# EasyEDA Pro project KAKUTE_mini.eprj

# Schematic KAKUTE-mini

## Sheets
1 主控: Create Date: 2023-04-20; Page Name: 主控; Project Name: KAKUTE_mini; Schematic Name: KAKUTE-mini; Update Date: 2023-05-05; Company: 嘉立创EDA; Drawed: WANG BIN; Page Size: A4; Version: V1.0
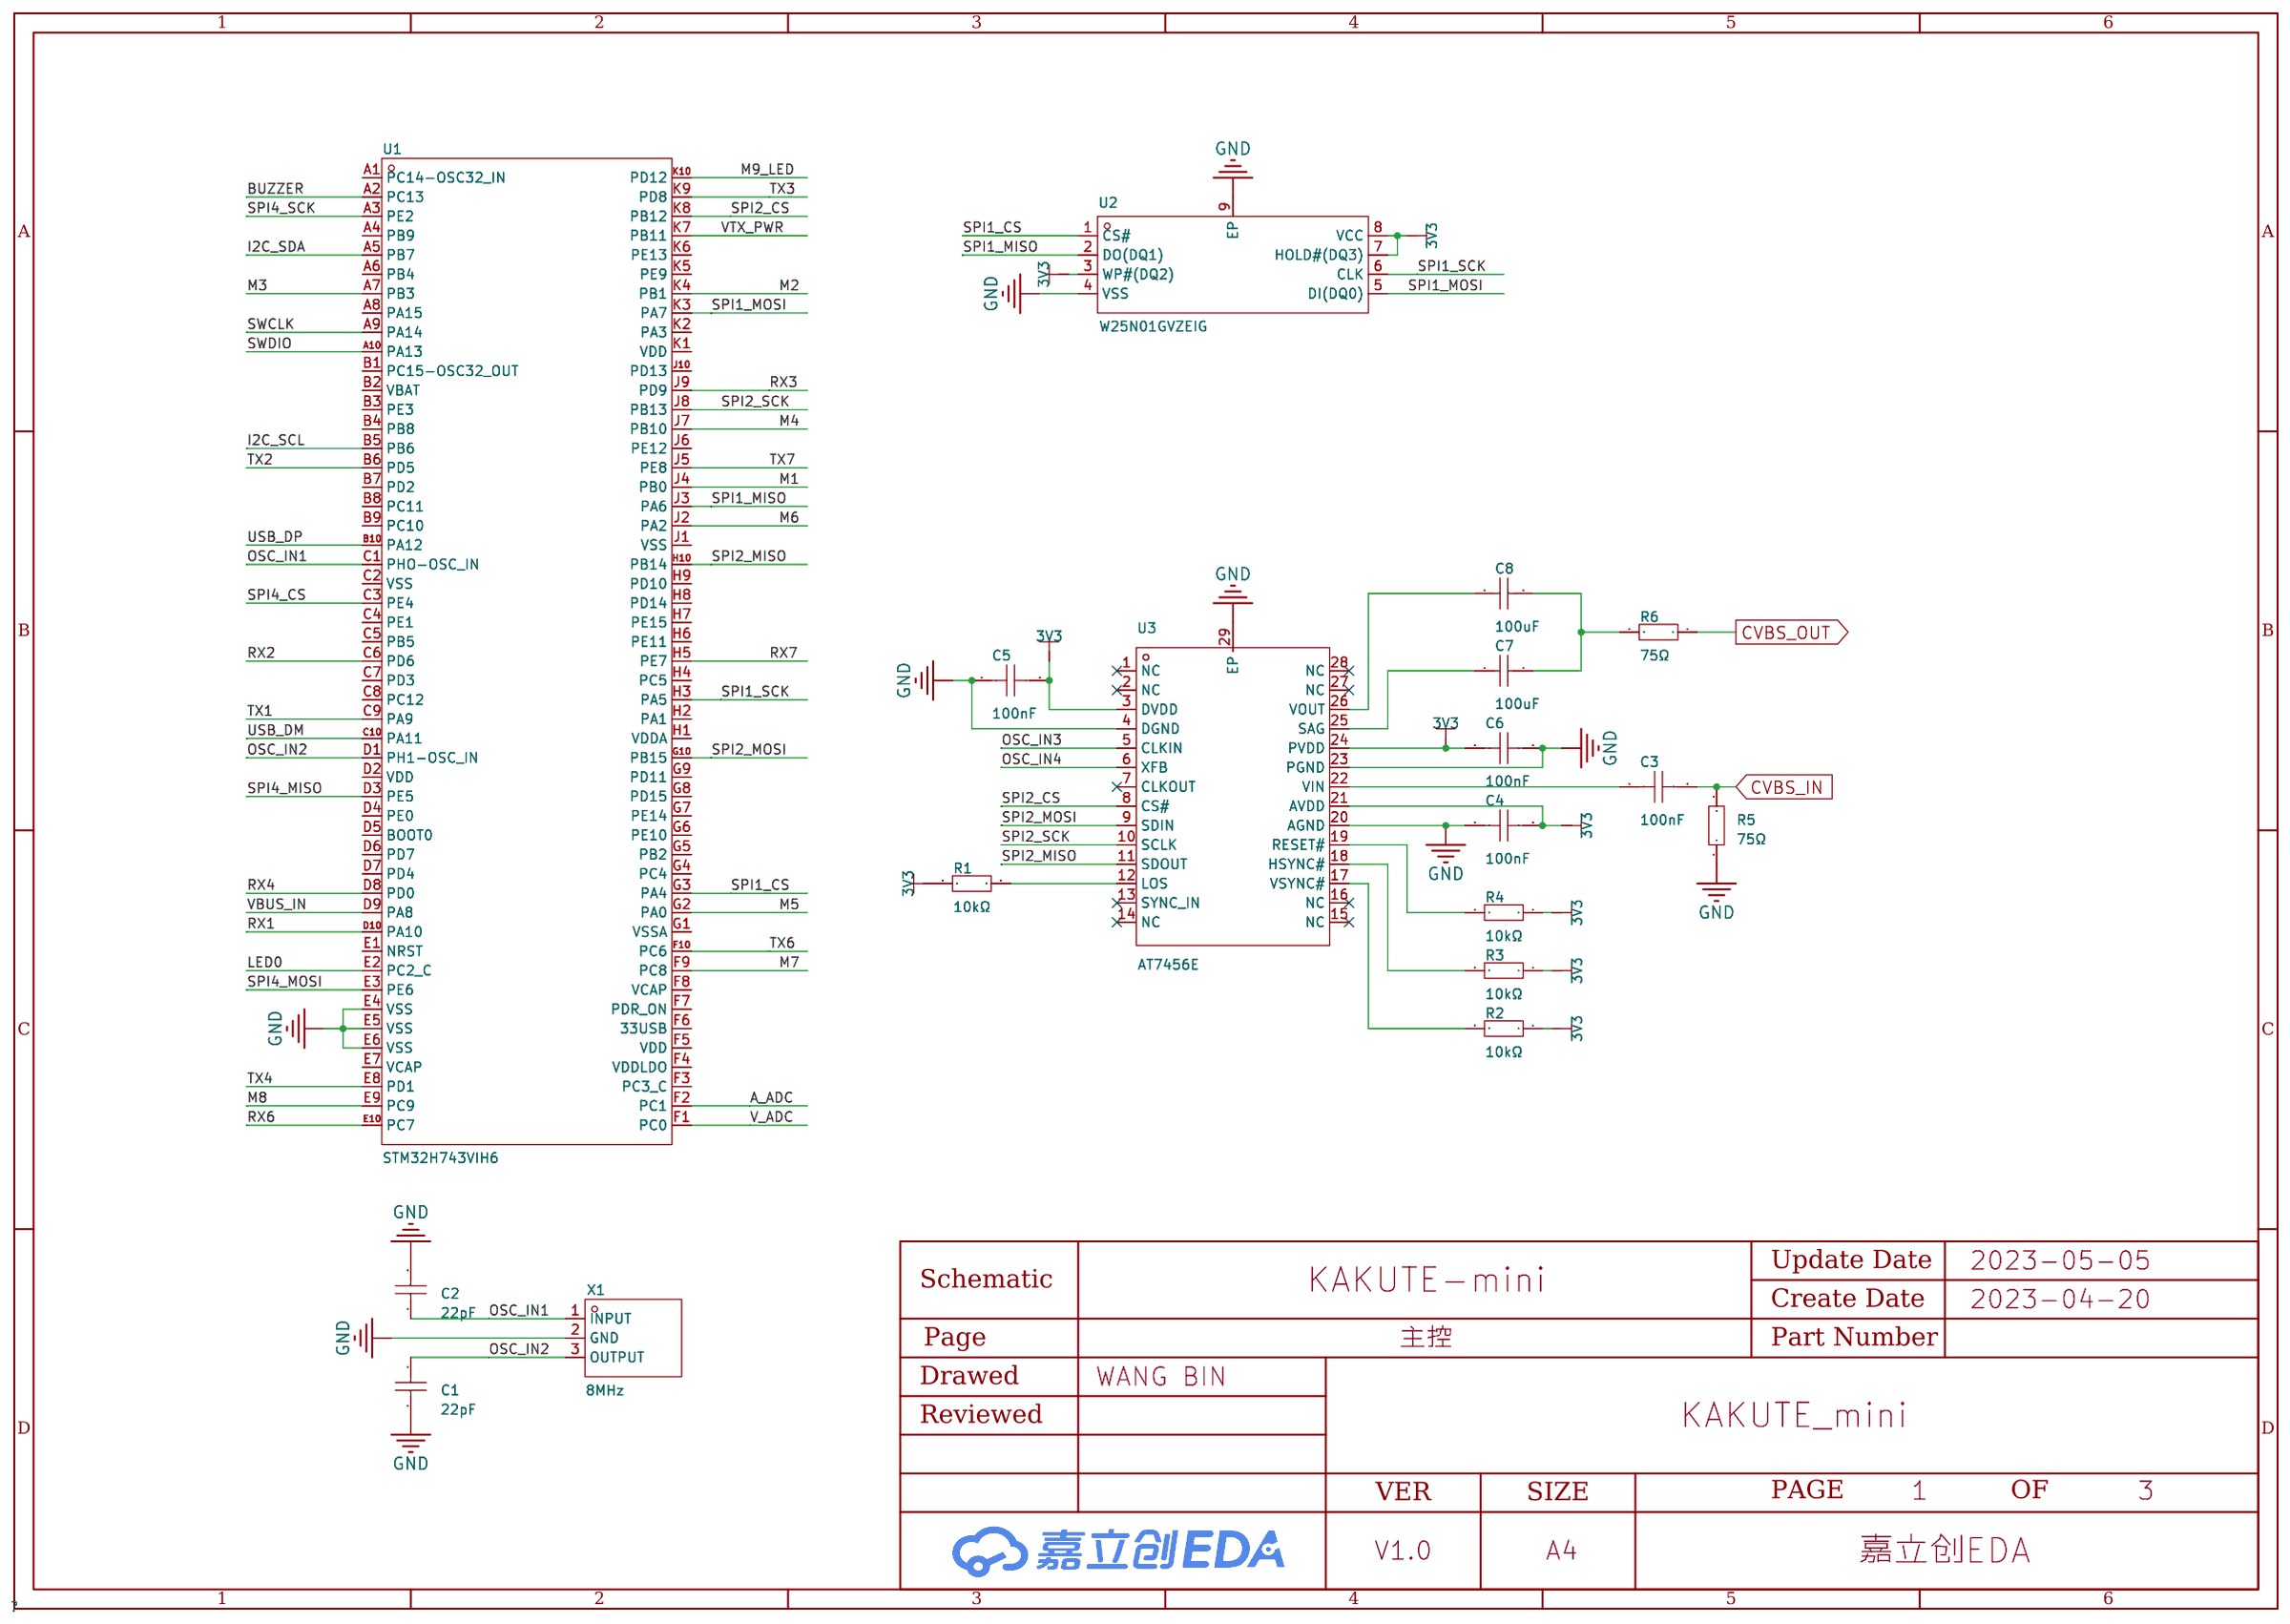
[diagram p0: 主控]
2 接插件: Page Name: 接插件; Update Date: 2023-04-20
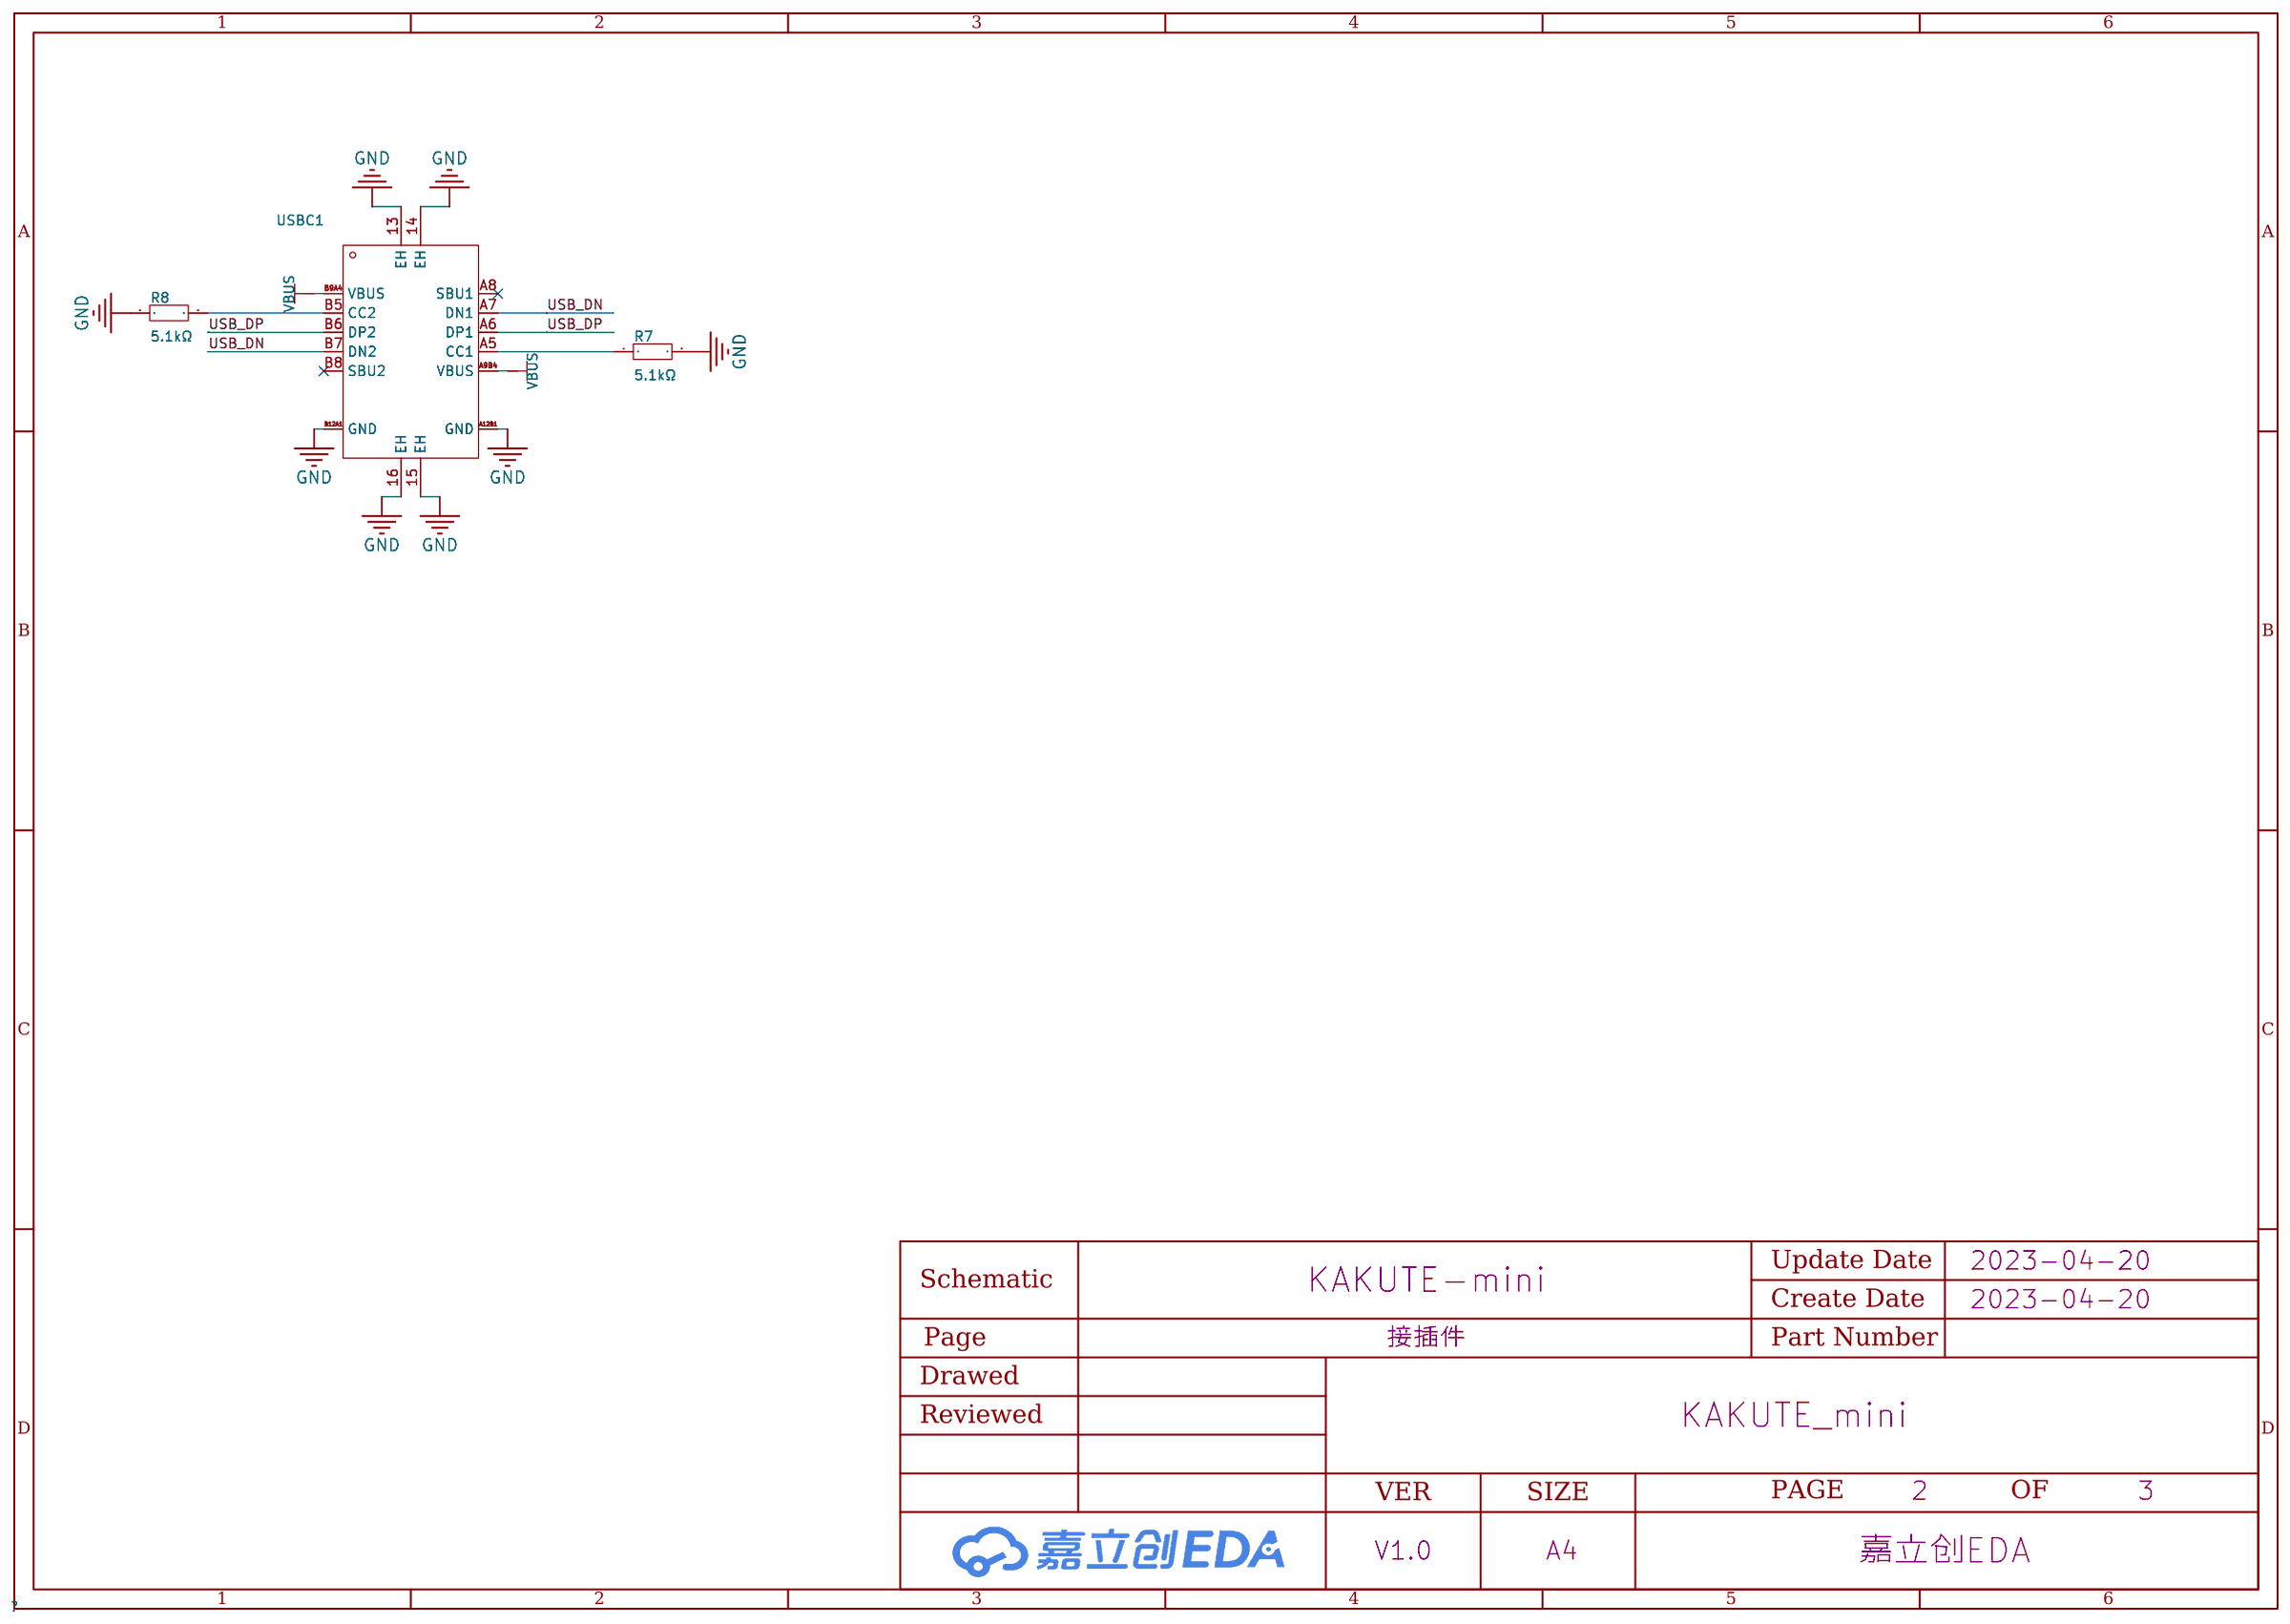
[diagram p1: 接插件]
3 传感器: Page Name: 传感器; Schematic Name: Schematic1; Update Date: 2023-04-20
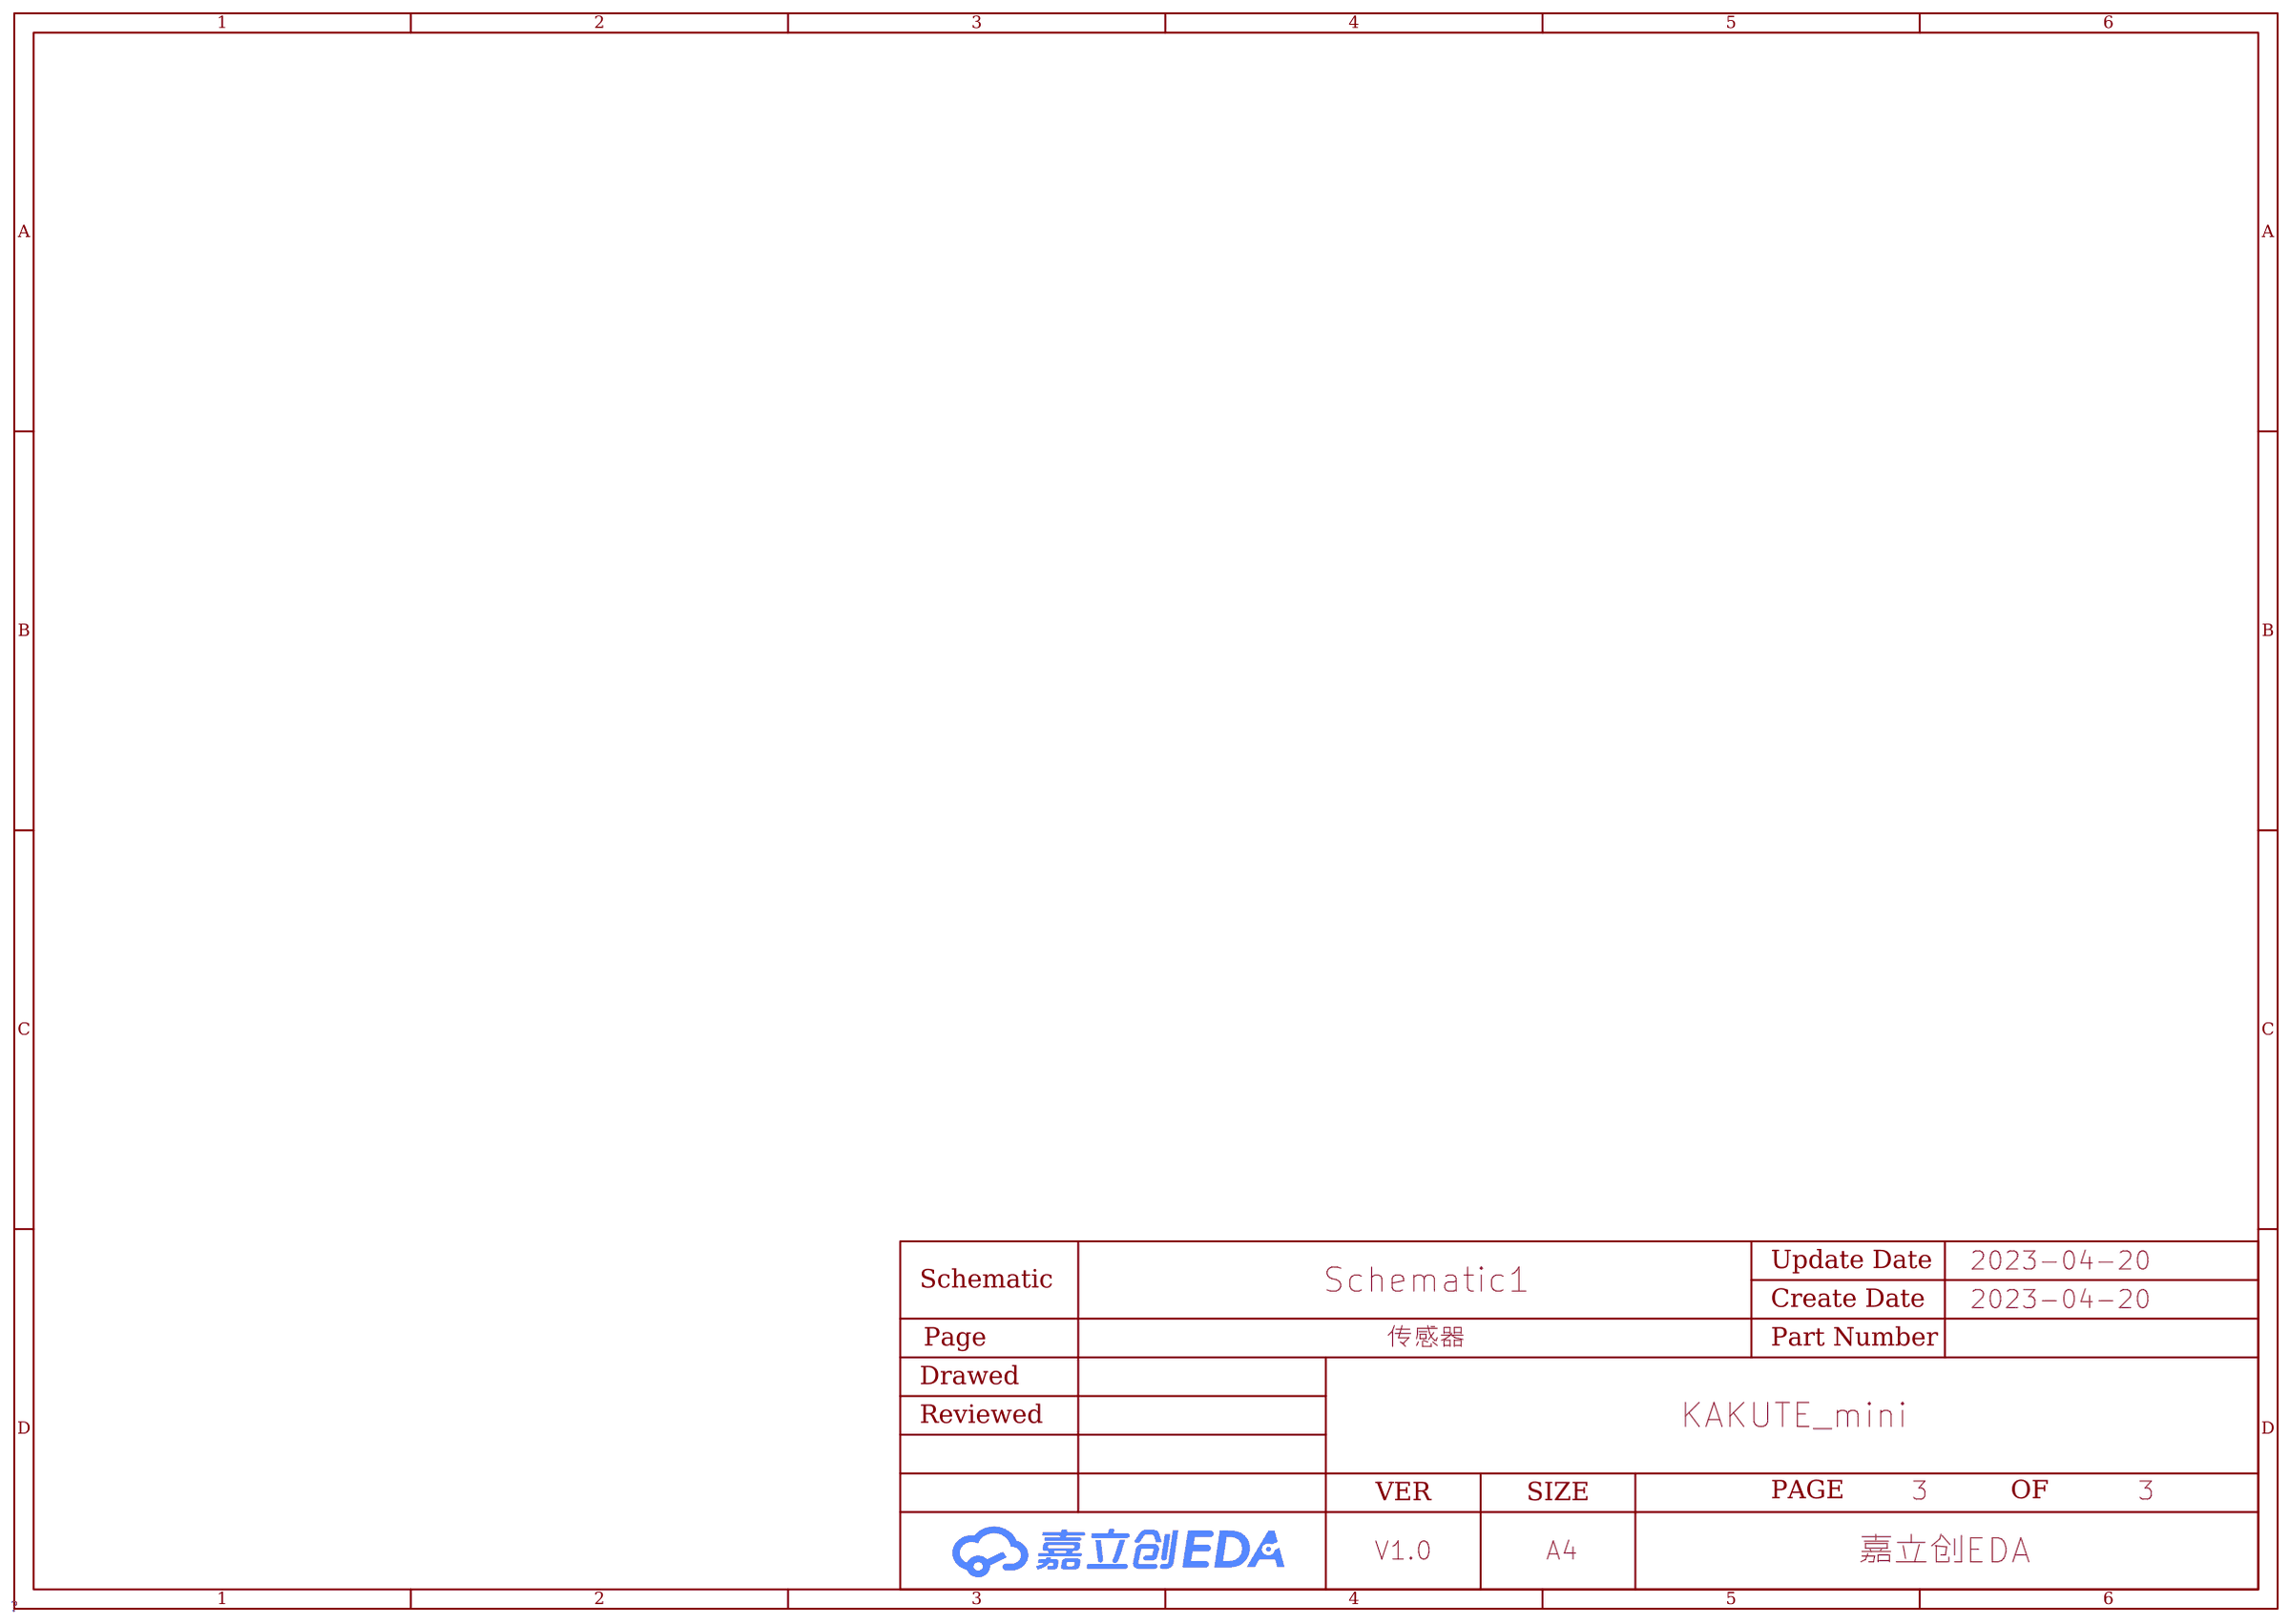
[diagram p2: 传感器]

## Parts
sheet 主控
C1  22pF  [C0402]
C2  22pF  [C0402]
C3  100nF  [C0402]
C4  100nF  [C0402]
C5  100nF  [C0402]
C6  100nF  [C0402]
C7  100uF  [C0805]
C8  100uF  [C0805]
R1  10kΩ  [R0402]
R2  10kΩ  [R0402]
R3  10kΩ  [R0402]
R4  10kΩ  [R0402]
R5  75Ω  [R0402]
R6  75Ω  [R0402]
U1  STM32H743VIH6  [BGA-100_L8.0-W8.0-P0.80-R10-C10-BL]
U2  W25N01GVZEIG  [WSON-8_L8.0-W6.10-P1.27-BL-EP]
U3  AT7456E  [TSSOP-28_L9.7-W4.4-P0.65-LS6.4-BL-EP-2]
X1  8MHz  [OSC-SMD_3P-L3.2-W1.3-P1.20-L]
sheet 接插件
R7  5.1kΩ  [R0402]
R8  5.1kΩ  [R0402]
USBC1  918-418K2024S40000  [USB-C-SMD_TYPE-C-USB-4]

## Library data of the parts
C1 C2 = 0402CG220J500NT: 容值:22pF;精度:±5%;额定电压:50V;材质(温度系数):C0G;; LCSC Part Name: 22pF ±5% 50V; Supplier Part: C1555; Manufacturer: FH(风华); Supplier Footprint: 0402; JLCPCB Part Class: 基础库; Datasheet: https://atta.szlcsc.com/upload/public/pdf/source/20170923/C1555_1506149269156988362.pdf; Supplier: LCSC; Tolerance: ±5%; Voltage Rated: 50V; Temperature Coefficient: C0G
C3-C6 = CL05B104KB54PNC: 容值:100nF;精度:±10%;额定电压:50V;材质(温度系数):X7R;; LCSC Part Name: 100nF ±10% 50V; Supplier Part: C307331; Manufacturer: SAMSUNG(三星); Supplier Footprint: 0402; JLCPCB Part Class: 基础库; Datasheet: https://atta.szlcsc.com/upload/public/pdf/source/20181009/C307331_222F7C870FD3EA5F46F538B483443886.pdf; Supplier: LCSC; Tolerance: ±10%; Voltage Rated: 50V; Temperature Coefficient: X7R
C7 C8 = GRM21BR60J107ME15L: 容值:100uF;精度:±20%;额定电压:6.3V;材质(温度系数):X5R;; LCSC Part Name: 100uF ±20% 6.3V; Supplier Part: C141660; Manufacturer: muRata(村田); Supplier Footprint: 0805; JLCPCB Part Class: Extended Part; Datasheet: https://atta.szlcsc.com/upload/public/pdf/source/20171113/C141660_15105613320671115822.pdf; Supplier: LCSC; Tolerance: ±20%; Voltage Rated: 6.3V; Temperature Coefficient: X5R
R1-R4 = 0402WGF1002TCE: 电阻类型:厚膜电阻;阻值:10kΩ;精度:±1%;功率:62.5mW;; LCSC Part Name: 10kΩ ±1% 62.5mW; Supplier Part: C25744; Manufacturer: UNI-ROYAL(厚声); Supplier Footprint: 0402; JLCPCB Part Class: Basic Part; Datasheet: https://atta.szlcsc.com/upload/public/pdf/source/20200306/C422600_1E6D84923E4A46A82E41ADD87F860B5C.pdf; Supplier: LCSC; Type: 厚膜电阻; Tolerance: ±1%; Power(Watts): 62.5mW; Temperature Coefficient: ±100ppm/℃; Overload Voltage (Max): 50V; Operating Temperature Range: -55℃~+155℃
R5 R6 = 0402WGF750JTCE: 电阻类型:厚膜电阻;阻值:75Ω;精度:±1%;功率:62.5mW;; LCSC Part Name: 75Ω ±1% 62.5mW; Supplier Part: C25133; Manufacturer: UNI-ROYAL(厚声); Supplier Footprint: 0402; JLCPCB Part Class: 基础库; Datasheet: https://atta.szlcsc.com/upload/public/pdf/source/20200306/C422600_1E6D84923E4A46A82E41ADD87F860B5C.pdf; Supplier: LCSC; Type: 厚膜电阻; Tolerance: ±1%; Power(Watts): 62.5mW; Temperature Coefficient: ±100ppm/℃; Overload Voltage (Max): 50V; Operating Temperature Range: -55℃~+155℃
U1 = STM32H743VIH6: 32位Arm Cortex -M7 480MHz mcu,高达2MB的Flash,高达1MB的RAM,46com和模拟接口; Supplier Part: C964146; Manufacturer: ST(意法半导体); Supplier Footprint: TFBGA-100; JLCPCB Part Class: 扩展库; Datasheet: https://atta.szlcsc.com/upload/public/pdf/source/20220307/46489B78091107FB73FE6602EFA9948C.pdf; Supplier: LCSC
U2 = W25N01GVZEIG: 存储器类型:-;存储器构架(格式):-;技术:-;存储器容量:-;时钟频率:-;存储器接口类型:-;; Supplier Part: C907680; Manufacturer: WINBOND(华邦); Supplier Footprint: WSON-8; JLCPCB Part Class: 扩展库; Datasheet: https://atta.szlcsc.com/upload/public/pdf/source/20201021/C907645_0A29D2C383E097D6F46BF0FEEFAA9DEB.pdf; Supplier: LCSC
U3 = AT7456E: 视频字符叠加芯片，跟MAX7456-pin-pin; Supplier Part: C82351; Manufacturer: 杭州中科微; Supplier Footprint: TSSOP-28; JLCPCB Part Class: 扩展库; Datasheet: https://atta.szlcsc.com/upload/public/pdf/source/20180326/C82351_A40539A53E8345C88178541014FDE5FB.pdf; Supplier: LCSC
X1 = CSTNE8M00GH5L000R0: 频率:8MHz;频率公差:±0.07%;频率稳定度:-;; LCSC Part Name: 8MHz ±0.07%; Supplier Part: C882602; Manufacturer: muRata(村田); Supplier Footprint: SMD3213-3P; JLCPCB Part Class: 扩展库; Datasheet: https://atta.szlcsc.com/upload/public/pdf/source/20210726/C882602_740E1448EDBB3C55C7DDB16518B64D07.pdf; Supplier: LCSC; Frequency Tolerance: ±0.07%; Operating Temperature: -40℃~+85℃
R7 R8 = 0402WGF5101TCE: 电阻类型:厚膜电阻;阻值:5.1kΩ;精度:±1%;功率:62.5mW;; LCSC Part Name: 5.1kΩ ±1% 62.5mW; Supplier Part: C25905; Manufacturer: UNI-ROYAL(厚声); Supplier Footprint: 0402; JLCPCB Part Class: 基础库; Datasheet: https://atta.szlcsc.com/upload/public/pdf/source/20200306/C422600_1E6D84923E4A46A82E41ADD87F860B5C.pdf; Supplier: LCSC; Type: 厚膜电阻; Tolerance: ±1%; Power(Watts): 62.5mW; Temperature Coefficient: ±100ppm/℃; Overload Voltage (Max): 50V; Operating Temperature Range: -55℃~+155℃
USBC1 = 918-418K2024S40000: 连接器类型:Type-C;标准:-;公母:母座;触点数量:16;端口数量:1;; LCSC Part Name: Type-C 母座; Supplier Part: C168688; Manufacturer: 精拓金; Supplier Footprint: SMD; JLCPCB Part Class: 扩展库; Datasheet: https://atta.szlcsc.com/upload/public/pdf/source/20210305/C168688_67E9870F07D1BBFDE7A21510679CE418.pdf; Supplier: LCSC; Connector Type: Type-C; Gender: 母座; Number of Contacts: 16; Number of Ports: 1

## Nets
3V3: C4.2 C5.2 C6.1 R1.1 R2.1 R3.1 R4.1 U2.3(WP#(DQ2)) U2.7(HOLD#(DQ3)) U2.8(VCC) U3.3(DVDD) U3.21(AVDD) U3.24(PVDD)
GND: C1.2 C2.2 C4.1 C5.1 C6.2 R5.1 R7.2 R8.1 U1.E4(VSS) U1.E5(VSS) U1.E6(VSS) U2.4(VSS) U2.9(EP) U3.4(DGND) U3.20(AGND) U3.23(PGND) U3.29(EP) USBC1.13(EH) USBC1.14(EH) USBC1.15(EH) USBC1.16(EH) USBC1.A12B1(GND) USBC1.B12A1(GND) X1.2(GND)
VBUS: USBC1.A9B4(VBUS) USBC1.B9A4(VBUS)
VBUS_IN: U1.D9(PA8)
A_ADC: U1.F2(PC1)
BUZZER: U1.A2(PC13)
CVBS_IN: C3.2 R5.2
CVBS_OUT: R6.1
I2C_SCL: U1.B5(PB6)
I2C_SDA: U1.A5(PB7)
LED0: U1.E2(PC2_C)
M1: U1.J4(PB0)
M2: U1.K4(PB1)
M3: U1.A7(PB3)
M4: U1.J7(PB10)
M5: U1.G2(PA0)
M6: U1.J2(PA2)
M7: U1.F9(PC8)
M8: U1.E9(PC9)
M9_LED: U1.K10(PD12)
OSC_IN1: C2.1 U1.C1(PHO-OSC_IN) X1.1(INPUT)
OSC_IN2: C1.1 U1.D1(PH1-OSC_IN) X1.3(OUTPUT)
OSC_IN3: U3.5(CLKIN)
OSC_IN4: U3.6(XFB)
RX1: U1.D10(PA10)
RX2: U1.C6(PD6)
RX3: U1.J9(PD9)
RX4: U1.D8(PD0)
RX6: U1.E10(PC7)
RX7: U1.H5(PE7)
SPI1_CS: U1.G3(PA4) U2.1(CS#)
SPI1_MISO: U1.J3(PA6) U2.2(DO(DQ1))
SPI1_MOSI: U1.K3(PA7) U2.5(DI(DQ0))
SPI1_SCK: U1.H3(PA5) U2.6(CLK)
SPI2_CS: U1.K8(PB12) U3.8(CS#)
SPI2_MISO: U1.H10(PB14) U3.11(SDOUT)
SPI2_MOSI: U1.G10(PB15) U3.9(SDIN)
SPI2_SCK: U1.J8(PB13) U3.10(SCLK)
SPI4_CS: U1.C3(PE4)
SPI4_MISO: U1.D3(PE5)
SPI4_MOSI: U1.E3(PE6)
SPI4_SCK: U1.A3(PE2)
SWCLK: U1.A9(PA14)
SWDIO: U1.A10(PA13)
TX1: U1.C9(PA9)
TX2: U1.B6(PD5)
TX3: U1.K9(PD8)
TX4: U1.E8(PD1)
TX6: U1.F10(PC6)
TX7: U1.J5(PE8)
USB_DM: U1.C10(PA11)
USB_DN: USBC1.A7(DN1) USBC1.B7(DN2)
USB_DP: U1.B10(PA12) USBC1.A6(DP1) USBC1.B6(DP2)
V_ADC: U1.F1(PC0)
VTX_PWR: U1.K7(PB11)
$1N3519: R1.2 U3.12(LOS)
$1N3965: R2.2 U3.17(VSYNC#)
$1N4203: R3.2 U3.18(HSYNC#)
$1N4208: R4.2 U3.19(RESET#)
$1N4273: C3.1 U3.22(VIN)
$1N4642: C8.1 U3.26(VOUT)
$1N4647: C7.1 U3.25(SAG)
$1N4793: C7.2 C8.2 R6.2
Net-(R7-1): R7.1 USBC1.A5(CC1)
Net-(R8-2): R8.2 USBC1.B5(CC2)

Not connected (* = marked no-connect by the designer): U1 A1(PC14-OSC32_IN) A4(PB9) A6(PB4) A8(PA15) B1(PC15-OSC32_OUT) B2(VBAT) B3(PE3) B4(PB8) B7(PD2) B8(PC11) B9(PC10) C2(VSS) C4(PE1) C5(PB5) C7(PD3) C8(PC12) D2(VDD) D4(PE0) D5(BOOT0) D6(PD7) D7(PD4) E1(NRST) E7(VCAP) F3(PC3_C) F4(VDDLDO) F5(VDD) F6(33USB) F7(PDR_ON) F8(VCAP) G1(VSSA) G4(PC4) G5(PB2) G6(PE10) G7(PE14) G8(PD15) G9(PD11) H1(VDDA) H2(PA1) H4(PC5) H6(PE11) H7(PE15) H8(PD14) H9(PD10) J1(VSS) J6(PE12) J10(PD13) K1(VDD) K2(PA3) K5(PE9) K6(PE13); U3 1(NC)* 2(NC)* 7(CLKOUT)* 13(SYNC_IN)* 14(NC)* 15(NC)* 16(NC)* 27(NC)* 28(NC)*; USBC1 A8(SBU1)* B8(SBU2)*

# Board PCB1
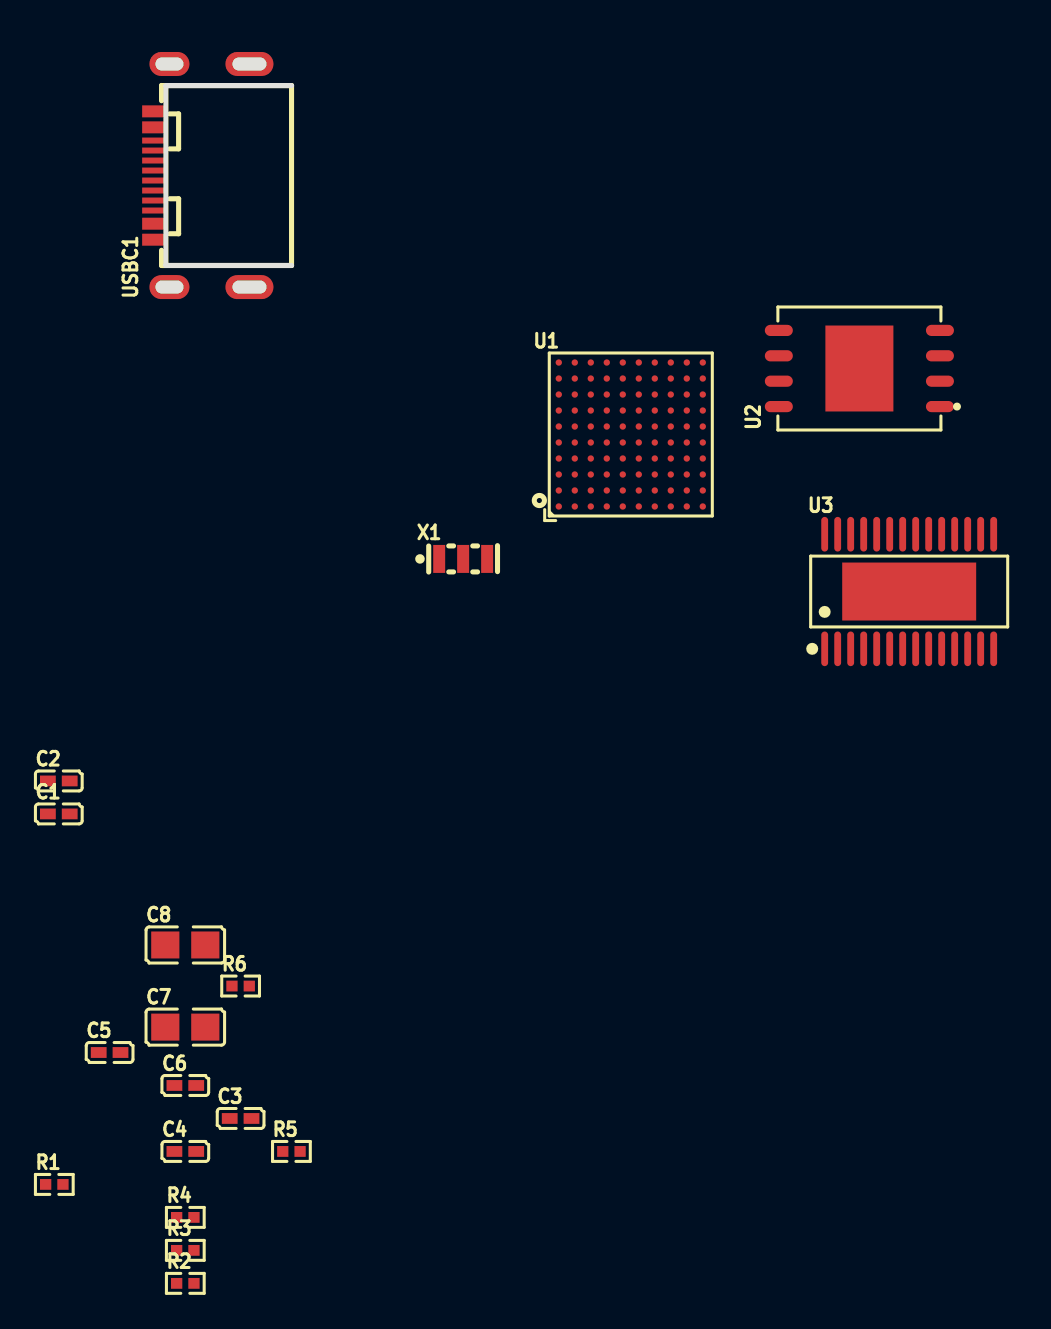
[diagram p3: board, top side]
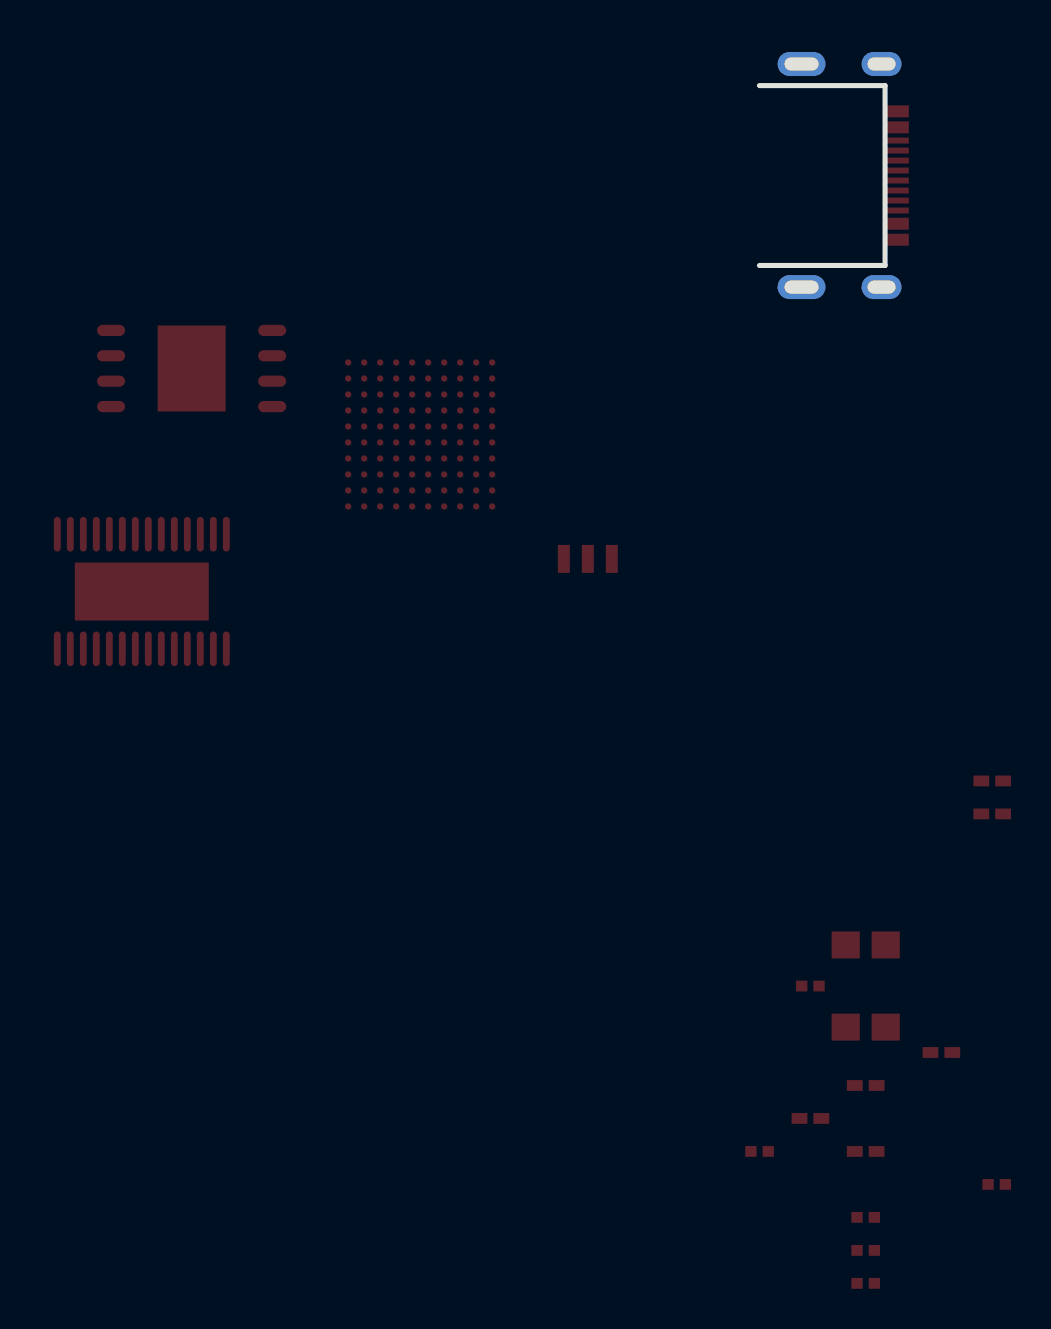
[diagram p4: board, bottom side, seen from below]

Outline 6.28 x 9 mm; copper layers: Top Layer, Bottom Layer. Coordinates in mm from the lower left corner of the outline.
Stack: Top Layer 0.035mm / Dielectric1 1.51mm FR4 er 4.5 / Bottom Layer 0.035mm

## Design rules (mm)
spacing safeClearance (default): track to track 0.152, other pairs 0.152 to 0.3
track width trackWidth (default): min 0.127, default 0.254, max 2.54
differential pair differentialPair (default): width min 0.127, default 0.254, max 2.54; gap min 0.152, default 0.152
via viaSize (default): diameter min 0.5, default 0.61, max 10; hole min 0.3, default 0.305, max 6

## Placement (name value [footprint] x y rotation side)
C1  22pF  [C0402]  -5.36 -27.43 0 top
C2  22pF  [C0402]  -5.36 -25.78 0 top
C3  100nF  [C0402]  3.73 -42.67 0 top
C4  100nF  [C0402]  0.97 -44.32 0 top
C5  100nF  [C0402]  -2.82 -39.37 0 top
C6  100nF  [C0402]  0.97 -41.02 0 top
C7  100uF  [C0805]  0.97 -38.1 0 top
C8  100uF  [C0805]  0.97 -33.99 0 top
R1  10kΩ  [R0402]  -5.58 -45.97 0 top
R2  10kΩ  [R0402]  0.97 -50.91 0 top
R3  10kΩ  [R0402]  0.97 -49.26 0 top
R4  10kΩ  [R0402]  0.97 -47.61 0 top
R5  75Ω  [R0402]  6.27 -44.32 0 top
R6  75Ω  [R0402]  3.73 -36.04 0 top
U1  STM32H743VIH6  [BGA-100_L8.0-W8.0-P0.80-R10-C10-BL]  23.24 -8.45 0 top
U2  W25N01GVZEIG  [WSON-8_L8.0-W6.10-P1.27-BL-EP]  34.67 -5.15 90 top
U3  AT7456E  [TSSOP-28_L9.7-W4.4-P0.65-LS6.4-BL-EP-2]  37.16 -16.31 0 top
USBC1  918-418K2024S40000  [USB-C-SMD_TYPE-C-USB-4]  1.78 4.5 90 top
X1  8MHz  [OSC-SMD_3P-L3.2-W1.3-P1.20-L]  14.86 -14.68 0 top

## Footprints (pads in the part's own frame, mm; a bottom-side part is the same pattern mirrored in y, then rotated)
BGA-100_L8.0-W8.0-P0.80-R10-C10-BL
  round 0.32 smd: A1(-3.6,-3.6) A2(-3.6,-2.8) A3(-3.6,-2) A4(-3.6,-1.2) A5(-3.6,-0.4) A6(-3.6,0.4) A7(-3.6,1.2) A8(-3.6,2) A9(-3.6,2.8) A10(-3.6,3.6) B1(-2.8,-3.6) B2(-2.8,-2.8) B3(-2.8,-2) B4(-2.8,-1.2) B5(-2.8,-0.4) B6(-2.8,0.4) B7(-2.8,1.2) B8(-2.8,2) B9(-2.8,2.8) B10(-2.8,3.6) C1(-2,-3.6) C2(-2,-2.8) C3(-2,-2) C4(-2,-1.2) C5(-2,-0.4) C6(-2,0.4) C7(-2,1.2) C8(-2,2) C9(-2,2.8) C10(-2,3.6) D1(-1.2,-3.6) D2(-1.2,-2.8) D3(-1.2,-2) D4(-1.2,-1.2) D5(-1.2,-0.4) D6(-1.2,0.4) D7(-1.2,1.2) D8(-1.2,2) D9(-1.2,2.8) D10(-1.2,3.6) E1(-0.4,-3.6) E2(-0.4,-2.8) E3(-0.4,-2) E4(-0.4,-1.2) E5(-0.4,-0.4) E6(-0.4,0.4) E7(-0.4,1.2) E8(-0.4,2) E9(-0.4,2.8) E10(-0.4,3.6) F1(0.4,-3.6) F2(0.4,-2.8) F3(0.4,-2) F4(0.4,-1.2) F5(0.4,-0.4) F6(0.4,0.4) F7(0.4,1.2) F8(0.4,2) F9(0.4,2.8) F10(0.4,3.6) G1(1.2,-3.6) G2(1.2,-2.8) G3(1.2,-2) G4(1.2,-1.2) G5(1.2,-0.4) G6(1.2,0.4) G7(1.2,1.2) G8(1.2,2) G9(1.2,2.8) G10(1.2,3.6) H1(2,-3.6) H2(2,-2.8) H3(2,-2) H4(2,-1.2) H5(2,-0.4) H6(2,0.4) H7(2,1.2) H8(2,2) H9(2,2.8) H10(2,3.6) J1(2.8,-3.6) J2(2.8,-2.8) J3(2.8,-2) J4(2.8,-1.2) J5(2.8,-0.4) J6(2.8,0.4) J7(2.8,1.2) J8(2.8,2) J9(2.8,2.8) J10(2.8,3.6) K1(3.6,-3.6) K2(3.6,-2.8) K3(3.6,-2) K4(3.6,-1.2) K5(3.6,-0.4) K6(3.6,0.4) K7(3.6,1.2) K8(3.6,2) K9(3.6,2.8) K10(3.6,3.6)
C0402
  rect 0.79x0.54 smd: 1(-0.545,0) 2(0.545,0)
C0805
  rect 1.41x1.35 smd: 1(-1,0) 2(1,0)
OSC-SMD_3P-L3.2-W1.3-P1.20-L
  rect 0.6x1.4 smd: 1(-1.199,0) 2(0,0) 3(1.199,0)
R0402
  rect 0.566x0.54 smd: 1(-0.433,0) 2(0.433,0)
TSSOP-28_L9.7-W4.4-P0.65-LS6.4-BL-EP-2
  oval 0.343x1.732 smd: 1(-4.225,-2.866) 2(-3.575,-2.866) 3(-2.925,-2.866) 4(-2.275,-2.866) 5(-1.625,-2.866) 6(-0.975,-2.866) 7(-0.325,-2.866) 8(0.325,-2.866) 9(0.975,-2.866) 10(1.625,-2.866) 11(2.275,-2.866) 12(2.925,-2.866) 13(3.575,-2.866) 14(4.225,-2.866) 15(4.225,2.866) 16(3.575,2.866) 17(2.925,2.866) 18(2.275,2.866) 19(1.625,2.866) 20(0.975,2.866) 21(0.325,2.866) 22(-0.325,2.866) 23(-0.975,2.866) 24(-1.625,2.866) 25(-2.275,2.866) 26(-2.925,2.866) 27(-3.575,2.866) 28(-4.225,2.866)
  rect 6.7x2.9 smd: 29(0,0)
USB-C-SMD_TYPE-C-USB-4
  oval 1.2x2 hole 0.65x1.4: 13(5.58,1.605) 16(-5.58,1.605)
  oval 1.2x2.4 hole 0.65x1.7: 14(5.58,-2.395) 15(-5.58,-2.395)
  rect 0.3x1.15 smd: A5(-1.25,2.395) A6(-0.25,2.395) A7(0.25,2.393) A8(1.25,2.395) B5(1.75,2.395) B6(0.75,2.395) B7(-0.75,2.393) B8(-1.75,2.395)
  rect 0.6x1.15 smd: A9B4(2.41,2.395) A12B1(3.21,2.395) B9A4(-2.41,2.395) B12A1(-3.21,2.395)
WSON-8_L8.0-W6.10-P1.27-BL-EP
  oval 0.56x1.4 smd: 1(-1.905,-4.027) 2(-0.635,-4.027) 3(0.635,-4.027) 4(1.905,-4.027) 5(1.905,4.027) 6(0.635,4.027) 7(-0.635,4.027) 8(-1.905,4.027)
  rect 4.3x3.4 smd: 9(0,0)

## Nets
As in the schematic.

Pads without a net: U1 A1 A4 A6 A8 B1 B2 B3 B4 B7 B8 B9 C2 C4 C5 C7 C8 D2 D4 D5 D6 D7 E1 E7 F3 F4 F5 F6 F7 F8 G1 G4 G5 G6 G7 G8 G9 H1 H2 H4 H6 H7 H8 H9 J1 J6 J10 K1 K2 K5 K6; U3 1 2 7 13 14 15 16 27 28; USBC1 A5 A8 B5 B8
